# EAGLE schematic FORÇA-SOPRADOR (EAGLE 6.1)
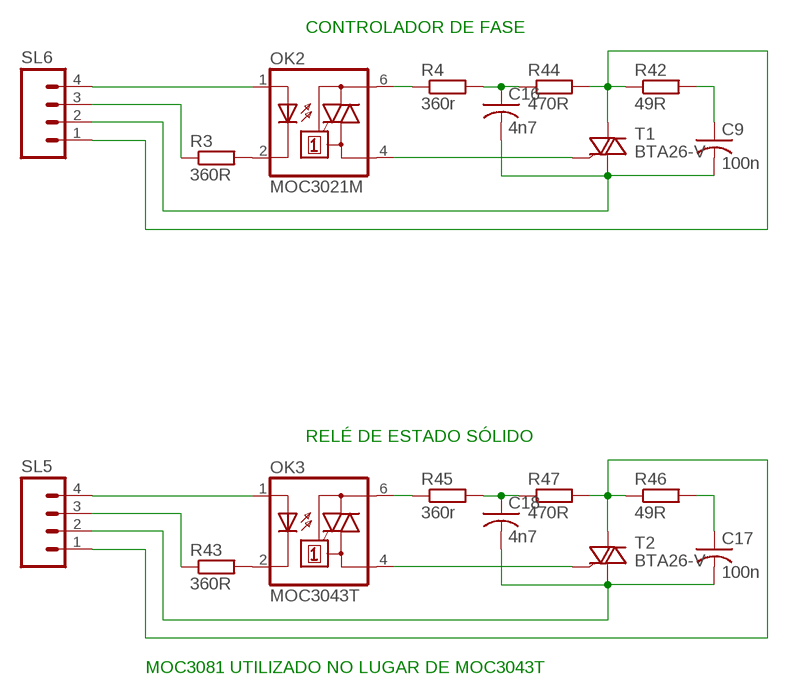
[diagram p0: schematic, sheet 1]

## Parts
C9  100n  C-US050-035X075  [C050-035X075]
C16  4n7  C-US050-035X075  [C050-035X075]
C17  100n  C-US050-035X075  [C050-035X075]
C18  4n7  C-US050-035X075  [C050-035X075]
OK2  MOC3021M  [DIL06]
OK3  MOC3043T  [DIL06B]
R3  360R  R-EU_0207/10  [0207/10]
R4  360r  R-EU_0207/10  [0207/10]
R42  49R  R-EU_0207/10  [0207/10]
R43  360R  R-EU_0207/10  [0207/10]
R44  470R  R-EU_0309/12  [0309/12]
R45  360r  R-EU_0207/10  [0207/10]
R46  49R  R-EU_0207/10  [0207/10]
R47  470R  R-EU_0309/12  [0309/12]
SL5  M04  [04P]
SL6  M04  [04P]
T1  BTA26-V  [TOP3S-1]
T2  BTA26-V  [TOP3S-1]

## Nets
N$22: OK2.6(A2) R4.1
N$24: C16.1 R4.2 R44.1
N$66: OK2.4(A1) T1.G
N$68: C9.2 C16.2 SL6.2 T1.A1
N$69: C9.1 R42.2
N$70: R42.1 R44.2 SL6.1 T1.A2
N$72: OK2.1(A) SL6.4
N$73: OK2.2(C) R3.2
N$74: R3.1 SL6.3
N$75: OK3.6(A2) R45.1
N$76: C18.1 R45.2 R47.1
N$77: OK3.4(A1) T2.G
N$78: C17.2 C18.2 SL5.2 T2.A1
N$79: C17.1 R46.2
N$80: R46.1 R47.2 SL5.1 T2.A2
N$81: OK3.1(A) SL5.4
N$82: OK3.2(C) R43.2
N$83: R43.1 SL5.3

## Notes on the sheet
- CONTROLADOR DE FASE
- RELÉ DE ESTADO SÓLIDO
- MOC3081 UTILIZADO NO LUGAR DE MOC3043T

## Library data of the parts
C9 C16-C18 = resistor:C-US: CAPACITOR, American symbol
OK2 = optocoupler:MOC30*M: RANDOM-PHASE OPTOISOLATORS TRIAC DRIVER OUTPUT Source: http://www.fairchildsemi.com MOC3020-M.pdf; MF: FAIRCHILD SEMICONDUCTOR; MPN: MOC3021-M; OC_FARNELL: 1021365; OC_NEWARK: 95B7895
OK3 = optocoupler:MOC30*: 6-Pin DIP Zero-Cross Optoisolators Triac Driver Output (250/400 Volt Peak) Source: http://www.fairchildsemi.com/ds/MO/MOC3043-M.pdf; MF: FAIRCHILD SEMICONDUCTOR; MPN: MOC3043TM; OC_FARNELL: unknown; OC_NEWARK: 34C1342
R3 R4 R42-R47 = resistor:R-EU_: RESISTOR, European symbol
SL5 SL6 = con-amp-quick:M04: AMP QUICK CONNECTOR; OC_FARNELL: unknown; OC_NEWARK: unknown
T1 T2 = triac:BTA26: 25A TRIAC Source: http://www.st.com/stonline/products/literature/ds/7470.pdf